# Altium schematic sheet radio.SchDoc: Radio
size A3; Author: Pietro Lorefice; Organization: DB Home System
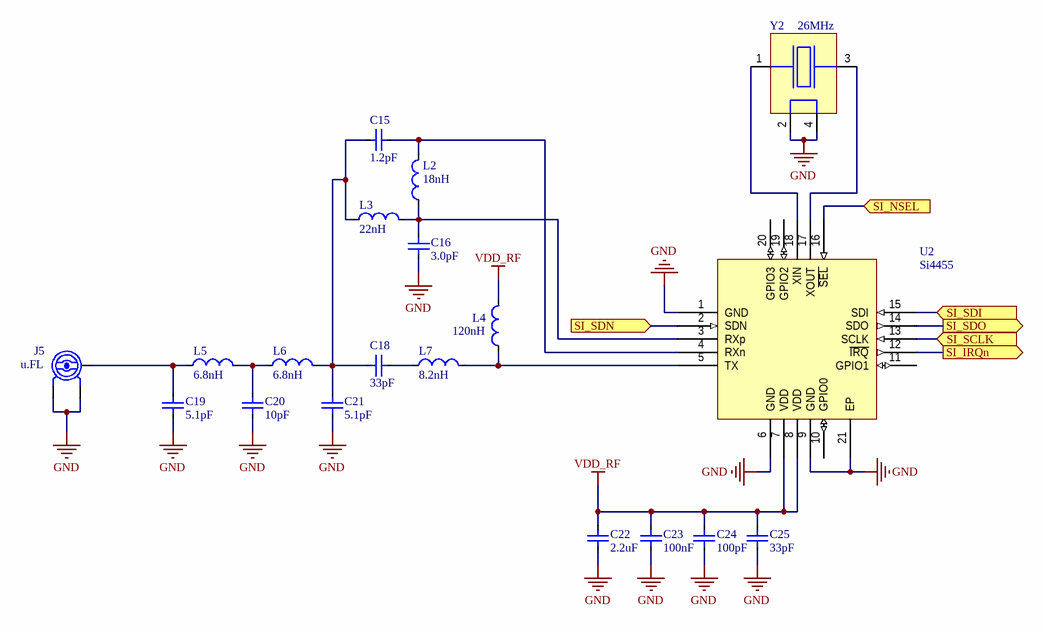
[diagram p0: radio.SchDoc]

## Parts
C15  1.2pF  [0402_[1005]]
C16  3.0pF  [0402_[1005]]
C18  33pF  [0402_[1005]]
C19  5.1pF  [0402_[1005]]
C20  10pF  [0402_[1005]]
C21  5.1pF  [0402_[1005]]
C22  2.2uF  [0603_[1608]]
C23  100nF  [0402_[1005]]
C24  100pF  [0402_[1005]]
C25  33pF  [0402_[1005]]
J5  u.FL  [U.FL_COAXIAL_2.6x2.6MM_STRAIGHT_SMD]
L2  18nH  [0402_[1005]]
L3  22nH  [0402_[1005]]
L4  120nH  [0402_[1005]]
L5  6.8nH  [0402_[1005]]
L6  6.8nH  [0402_[1005]]
L7  8.2nH  [0402_[1005]]
U2  Si4455  [QFN50P300X300X90_HS-21N]
Y2  26MHz  [CRYSTAL_2.5X2MM_4P_SMD]

## Ports
SI_IRQn (out), SI_NSEL (in), SI_SCLK (in), SI_SDI (in), SI_SDN (in), SI_SDO (out)

## Nets
GND: C16.1 C19.1 C20.1 C21.1 C22.1 C23.1 C24.1 C25.1 J5.2(GND) J5.3(GND) U2.1(GND) U2.6(GND) U2.9(GND) U2.21(EP) Y2.2 Y2.4
VDD_RF: C22.2 C23.2 C24.2 C25.2 L4.2 U2.7(VDD) U2.8(VDD)
SI_IRQn: U2.12(~{IRQ}) ; port SI_IRQn
SI_NSEL: U2.16(~{SEL}) ; port SI_NSEL
SI_SCLK: U2.13(SCLK) ; port SI_SCLK
SI_SDI: U2.15(SDI) ; port SI_SDI
SI_SDN: U2.2(SDN) ; port SI_SDN
SI_SDO: U2.14(SDO) ; port SI_SDO
NetC15_1: C15.1 C18.1 C21.2 L3.1 L6.2
NetC15_2: C15.2 L2.2 U2.4(RXn)
NetC16_2: C16.2 L2.1 L3.2 U2.3(RXp)
NetC18_2: C18.2 L7.1
NetC19_2: C19.2 J5.1(SIG) L5.1
NetC20_2: C20.2 L5.2 L6.1
NetL4_1: L4.1 L7.2 U2.5(TX)
NetU2_17: U2.17(XOUT) Y2.3
NetU2_18: U2.18(XIN) Y2.1

Not connected (* = marked no-connect by the designer): U2 10(GPIO0) 11(GPIO1) 19(GPIO2) 20(GPIO3)

## Notes on the sheet
- Project:
- Title:
- Author:
- Licensed:
- Rev:
- Size:
- A3
- File:
- Date:
- Sheet
- of

## Library data of the parts
C15 C16 C18-C25 = C: Capacitor
  C15: Value: 1.2pF
  C16: Value: 3.0pF
  C18 C25: Value: 33pF
  C19 C21: Value: 5.1pF
  C20: Value: 10pF
  C22: Value: 2.2uF
  C23: Value: 100nF
  C24: Value: 100pF
J5 = u.FL: u.FL antenna connector; pin to pad: 1>3 3>1
L2-L7 = L: Inductor
  L2: Value: 18nH
  L3: Value: 22nH
  L4: Value: 120nH
  L5 L6: Value: 6.8nH
  L7: Value: 8.2nH
U2 = Si4455: Low-current OOK/(G)FSK sub-GHz transceiver
Y2 = XTAL-4: Crystal oscillator, 4-pin; Value: 26MHz